# Altium schematic sheet STM32F407.SchDoc
size A3
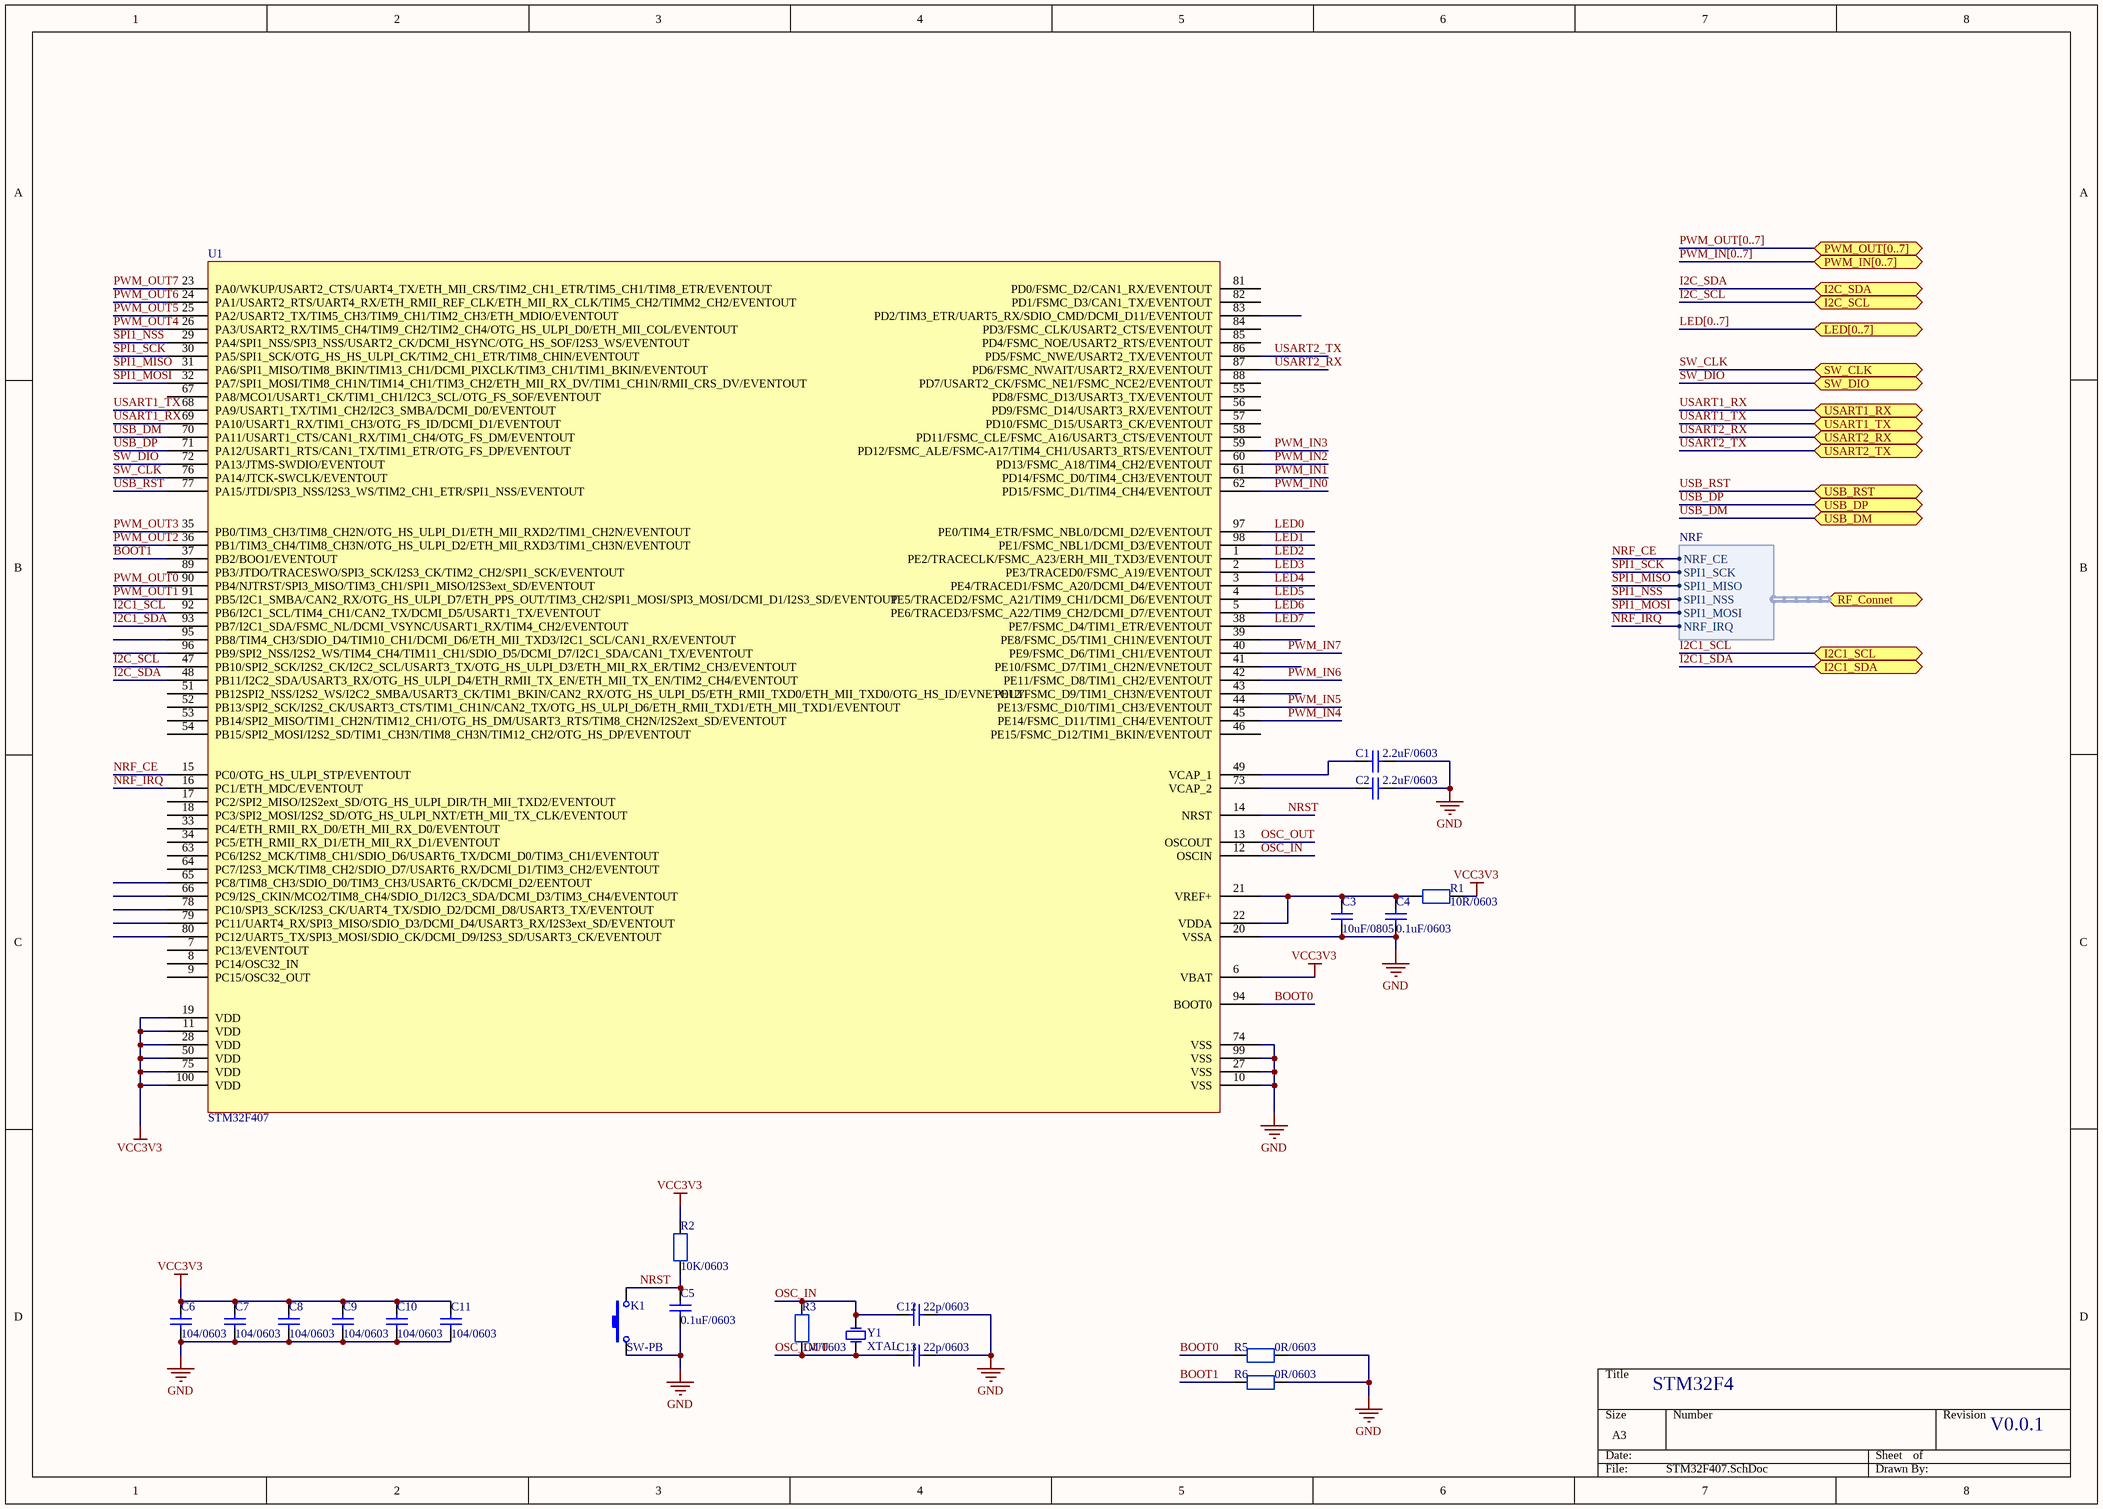
[diagram p0: STM32F407.SchDoc]

## Parts
C1  2.2uF/0603  [C0603]
C2  2.2uF/0603  [C0603]
C3  10uF/0805  [C0805]
C4  0.1uF/0603  [C0603]
C5  0.1uF/0603  [C0603]
C6  104/0603  [C0603]
C7  104/0603  [C0603]
C8  104/0603  [C0603]
C9  104/0603  [C0603]
C10  104/0603  [C0603]
C11  104/0603  [C0603]
C12  22p/0603  [C0603]
C13  22p/0603  [C0603]
K1  SW-PB  [SW-PB-A1]
R1  10R/0603  [R0603]
R2  10K/0603  [R0603]
R3  1M/0603  [R0603]
R5  0R/0603  [R0603]
R6  0R/0603  [R0402]
U1  STM32F407  [LQFP100-N]
Y1  XTAL  [XTAL-3225]

## Ports
I2C1_SCL, I2C1_SDA, I2C_SCL, I2C_SDA, LED[0..7], PWM_IN[0..7], PWM_OUT[0..7], RF_Connet (harness NRF), SW_CLK, SW_DIO, USART1_RX, USART1_TX, USART2_RX, USART2_TX, USB_DM, USB_DP, USB_RST

## Harnesses
NRF: NRF_CE, SPI1_SCK, SPI1_MISO, SPI1_NSS, SPI1_MOSI, NRF_IRQ

## Nets
GND: C1.1 C2.1 C3.1 C4.1 C5.1 C6.1 C7.1 C8.1 C9.1 C10.1 C11.1 C12.1 C13.1 K1.1 R5.2 R6.2 U1.10(VSS) U1.20(VSSA) U1.27(VSS) U1.74(VSS) U1.99(VSS)
VCC3V3: C6.2 C7.2 C8.2 C9.2 C10.2 C11.2 R1.1 R2.2 U1.6(VBAT) U1.11(VDD) U1.19(VDD) U1.28(VDD) U1.50(VDD) U1.75(VDD) U1.100(VDD)
BOOT0: R5.1 U1.94(BOOT0)
BOOT1: R6.1 U1.37(PB2/BOO1/EVENTOUT)
I2C1_SCL: U1.92(PB6/I2C1_SCL/TIM4_CH1/CAN2_TX/DCMI_D5/USART1_TX/EVENTOUT) ; port I2C1_SCL
I2C1_SDA: U1.93(PB7/I2C1_SDA/FSMC_NL/DCMI_VSYNC/USART1_RX/TIM4_CH2/EVENTOUT) ; port I2C1_SDA
I2C_SCL: U1.47(PB10/SPI2_SCK/I2S2_CK/I2C2_SCL/USART3_TX/OTG_HS_ULPI_D3/ETH_MII_RX_ER/TIM2_CH3/EVENTOUT) ; port I2C_SCL
I2C_SDA: U1.48(PB11/I2C2_SDA/USART3_RX/OTG_HS_ULPI_D4/ETH_RMII_TX_EN/ETH_MII_TX_EN/TIM2_CH4/EVENTOUT) ; port I2C_SDA
LED0: U1.97(PE0/TIM4_ETR/FSMC_NBL0/DCMI_D2/EVENTOUT)
LED1: U1.98(PE1/FSMC_NBL1/DCMI_D3/EVENTOUT)
LED2: U1.1(PE2/TRACECLK/FSMC_A23/ERH_MII_TXD3/EVENTOUT)
LED3: U1.2(PE3/TRACED0/FSMC_A19/EVENTOUT)
LED4: U1.3(PE4/TRACED1/FSMC_A20/DCMI_D4/EVENTOUT)
LED5: U1.4(PE5/TRACED2/FSMC_A21/TIM9_CH1/DCMI_D6/EVENTOUT)
LED6: U1.5(PE6/TRACED3/FSMC_A22/TIM9_CH2/DCMI_D7/EVENTOUT)
LED7: U1.38(PE7/FSMC_D4/TIM1_ETR/EVENTOUT)
NRF_CE: U1.15(PC0/OTG_HS_ULPI_STP/EVENTOUT) ; port RF_Connet.NRF_CE
NRF_IRQ: U1.16(PC1/ETH_MDC/EVENTOUT) ; port RF_Connet.NRF_IRQ
NRST: C5.2 K1.2 R2.1 U1.14(NRST)
OSC_IN: C12.2 R3.2 U1.12(OSCIN) Y1.2(OSC2)
OSC_OUT: C13.2 R3.1 U1.13(OSCOUT) Y1.1(OSC1)
PWM_IN0: U1.62(PD15/FSMC_D1/TIM4_CH4/EVENTOUT)
PWM_IN1: U1.61(PD14/FSMC_D0/TIM4_CH3/EVENTOUT)
PWM_IN2: U1.60(PD13/FSMC_A18/TIM4_CH2/EVENTOUT)
PWM_IN3: U1.59(PD12/FSMC_ALE/FSMC-A17/TIM4_CH1/USART3_RTS/EVENTOUT)
PWM_IN4: U1.45(PE14/FSMC_D11/TIM1_CH4/EVENTOUT)
PWM_IN5: U1.44(PE13/FSMC_D10/TIM1_CH3/EVENTOUT)
PWM_IN6: U1.42(PE11/FSMC_D8/TIM1_CH2/EVENTOUT)
PWM_IN7: U1.40(PE9/FSMC_D6/TIM1_CH1/EVENTOUT)
PWM_OUT0: U1.90(PB4/NJTRST/SPI3_MISO/TIM3_CH1/SPI1_MISO/I2S3ext_SD/EVENTOUT)
PWM_OUT1: U1.91(PB5/I2C1_SMBA/CAN2_RX/OTG_HS_ULPI_D7/ETH_PPS_OUT/TIM3_CH2/SPI1_MOSI/SPI3_MOSI/DCMI_D1/I2S3_SD/EVENTOUT)
PWM_OUT2: U1.36(PB1/TIM3_CH4/TIM8_CH3N/OTG_HS_ULPI_D2/ETH_MII_RXD3/TIM1_CH3N/EVENTOUT)
PWM_OUT3: U1.35(PB0/TIM3_CH3/TIM8_CH2N/OTG_HS_ULPI_D1/ETH_MII_RXD2/TIM1_CH2N/EVENTOUT)
PWM_OUT4: U1.26(PA3/USART2_RX/TIM5_CH4/TIM9_CH2/TIM2_CH4/OTG_HS_ULPI_D0/ETH_MII_COL/EVENTOUT)
PWM_OUT5: U1.25(PA2/USART2_TX/TIM5_CH3/TIM9_CH1/TIM2_CH3/ETH_MDIO/EVENTOUT)
PWM_OUT6: U1.24(PA1/USART2_RTS/UART4_RX/ETH_RMII_REF_CLK/ETH_MII_RX_CLK/TIM5_CH2/TIMM2_CH2/EVENTOUT)
PWM_OUT7: U1.23(PA0/WKUP/USART2_CTS/UART4_TX/ETH_MII_CRS/TIM2_CH1_ETR/TIM5_CH1/TIM8_ETR/EVENTOUT)
SPI1_MISO: U1.31(PA6/SPI1_MISO/TIM8_BKIN/TIM13_CH1/DCMI_PIXCLK/TIM3_CH1/TIM1_BKIN/EVENTOUT) ; port RF_Connet.SPI1_MISO
SPI1_MOSI: U1.32(PA7/SPI1_MOSI/TIM8_CH1N/TIM14_CH1/TIM3_CH2/ETH_MII_RX_DV/TIM1_CH1N/RMII_CRS_DV/EVENTOUT) ; port RF_Connet.SPI1_MOSI
SPI1_NSS: U1.29(PA4/SPI1_NSS/SPI3_NSS/USART2_CK/DCMI_HSYNC/OTG_HS_SOF/I2S3_WS/EVENTOUT) ; port RF_Connet.SPI1_NSS
SPI1_SCK: U1.30(PA5/SPI1_SCK/OTG_HS_HS_ULPI_CK/TIM2_CH1_ETR/TIM8_CHIN/EVENTOUT) ; port RF_Connet.SPI1_SCK
SW_CLK: U1.76(PA14/JTCK-SWCLK/EVENTOUT) ; port SW_CLK
SW_DIO: U1.72(PA13/JTMS-SWDIO/EVENTOUT) ; port SW_DIO
USART1_RX: U1.69(PA10/USART1_RX/TIM1_CH3/OTG_FS_ID/DCMI_D1/EVENTOUT) ; port USART1_RX
USART1_TX: U1.68(PA9/USART1_TX/TIM1_CH2/I2C3_SMBA/DCMI_D0/EVENTOUT) ; port USART1_TX
USART2_RX: U1.87(PD6/FSMC_NWAIT/USART2_RX/EVENTOUT) ; port USART2_RX
USART2_TX: U1.86(PD5/FSMC_NWE/USART2_TX/EVENTOUT) ; port USART2_TX
USB_DM: U1.70(PA11/USART1_CTS/CAN1_RX/TIM1_CH4/OTG_FS_DM/EVENTOUT) ; port USB_DM
USB_DP: U1.71(PA12/USART1_RTS/CAN1_TX/TIM1_ETR/OTG_FS_DP/EVENTOUT) ; port USB_DP
USB_RST: U1.77(PA15/JTDI/SPI3_NSS/I2S3_WS/TIM2_CH1_ETR/SPI1_NSS/EVENTOUT) ; port USB_RST
NetC1_2: C1.2 U1.49(VCAP_1)
NetC2_2: C2.2 U1.73(VCAP_2)
NetC3_2: C3.2 C4.2 R1.2 U1.21(VREF+) U1.22(VDDA)

Not connected (* = marked no-connect by the designer): U1 7(PC13/EVENTOUT) 8(PC14/OSC32_IN) 9(PC15/OSC32_OUT) 17(PC2/SPI2_MISO/I2S2ext_SD/OTG_HS_ULPI_DIR/TH_MII_TXD2/EVENTOUT) 18(PC3/SPI2_MOSI/I2S2_SD/OTG_HS_ULPI_NXT/ETH_MII_TX_CLK/EVENTOUT) 33(PC4/ETH_RMII_RX_D0/ETH_MII_RX_D0/EVENTOUT) 34(PC5/ETH_RMII_RX_D1/ETH_MII_RX_D1/EVENTOUT) 39(PE8/FSMC_D5/TIM1_CH1N/EVENTOUT) 41(PE10/FSMC_D7/TIM1_CH2N/EVNETOUT) 43(PE12/FSMC_D9/TIM1_CH3N/EVENTOUT) 46(PE15/FSMC_D12/TIM1_BKIN/EVENTOUT) 51(PB12SPI2_NSS/I2S2_WS/I2C2_SMBA/USART3_CK/TIM1_BKIN/CAN2_RX/OTG_HS_ULPI_D5/ETH_RMII_TXD0/ETH_MII_TXD0/OTG_HS_ID/EVNETOUT) 52(PB13/SPI2_SCK/I2S2_CK/USART3_CTS/TIM1_CH1N/CAN2_TX/OTG_HS_ULPI_D6/ETH_RMII_TXD1/ETH_MII_TXD1/EVENTOUT) 53(PB14/SPI2_MISO/TIM1_CH2N/TIM12_CH1/OTG_HS_DM/USART3_RTS/TIM8_CH2N/I2S2ext_SD/EVENTOUT) 54(PB15/SPI2_MOSI/I2S2_SD/TIM1_CH3N/TIM8_CH3N/TIM12_CH2/OTG_HS_DP/EVENTOUT) 55(PD8/FSMC_D13/USART3_TX/EVENTOUT) 56(PD9/FSMC_D14/USART3_RX/EVENTOUT) 57(PD10/FSMC_D15/USART3_CK/EVENTOUT) 58(PD11/FSMC_CLE/FSMC_A16/USART3_CTS/EVENTOUT) 63(PC6/I2S2_MCK/TIM8_CH1/SDIO_D6/USART6_TX/DCMI_D0/TIM3_CH1/EVENTOUT) 64(PC7/I2S3_MCK/TIM8_CH2/SDIO_D7/USART6_RX/DCMI_D1/TIM3_CH2/EVENTOUT) 65(PC8/TIM8_CH3/SDIO_D0/TIM3_CH3/USART6_CK/DCMI_D2/EENTOUT) 66(PC9/I2S_CKIN/MCO2/TIM8_CH4/SDIO_D1/I2C3_SDA/DCMI_D3/TIM3_CH4/EVENTOUT) 67(PA8/MCO1/USART1_CK/TIM1_CH1/I2C3_SCL/OTG_FS_SOF/EVENTOUT) 78(PC10/SPI3_SCK/I2S3_CK/UART4_TX/SDIO_D2/DCMI_D8/USART3_TX/EVENTOUT) 79(PC11/UART4_RX/SPI3_MISO/SDIO_D3/DCMI_D4/USART3_RX/I2S3ext_SD/EVENTOUT) 80(PC12/UART5_TX/SPI3_MOSI/SDIO_CK/DCMI_D9/I2S3_SD/USART3_CK/EVENTOUT) 81(PD0/FSMC_D2/CAN1_RX/EVENTOUT) 82(PD1/FSMC_D3/CAN1_TX/EVENTOUT) 83(PD2/TIM3_ETR/UART5_RX/SDIO_CMD/DCMI_D11/EVENTOUT) 84(PD3/FSMC_CLK/USART2_CTS/EVENTOUT) 85(PD4/FSMC_NOE/USART2_RTS/EVENTOUT) 88(PD7/USART2_CK/FSMC_NE1/FSMC_NCE2/EVENTOUT) 89(PB3/JTDO/TRACESWO/SPI3_SCK/I2S3_CK/TIM2_CH2/SPI1_SCK/EVENTOUT) 95(PB8/TIM4_CH3/SDIO_D4/TIM10_CH1/DCMI_D6/ETH_MII_TXD3/I2C1_SCL/CAN1_RX/EVENTOUT) 96(PB9/SPI2_NSS/I2S2_WS/TIM4_CH4/TIM11_CH1/SDIO_D5/DCMI_D7/I2C1_SDA/CAN1_TX/EVENTOUT)

## Buses and harness runs
bus LED[0..7] = port LED[0..7]
bus PWM_IN[0..7] = port PWM_IN[0..7]
bus PWM_OUT[0..7] = port PWM_OUT[0..7]

## Notes on the sheet
- STM32F4
- V0.0.1

## Library data of the parts
C1-C13 = CAP: 无极性贴片电容
R1-R3 R5 R6 = RES
U1 = STM32F4: STM32F407VGT6